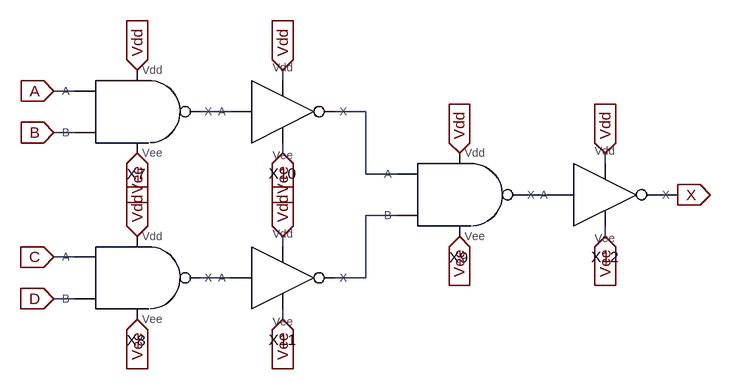
[diagram p0: schematic 4-NAND.asc]
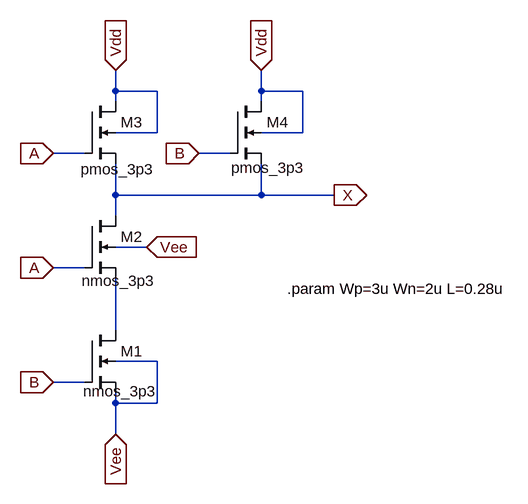
[diagram p1: sub-circuit nand2x1.asc]
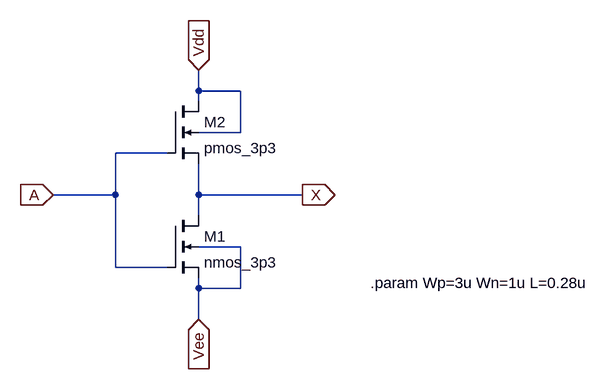
[diagram p2: sub-circuit invx1.asc]
4-NAND.asc, the LTspice schematic file:
Version 4.1
SHEET 1 880 680
WIRE -32 -64 -32 -80
WIRE -352 -48 -384 -48
WIRE -112 -16 -160 -16
WIRE 96 -16 48 -16
WIRE -352 16 -384 16
WIRE -32 48 -32 32
WIRE 464 64 464 48
WIRE 96 80 96 -16
WIRE 144 80 96 80
WIRE 384 112 336 112
WIRE 576 112 544 112
WIRE 144 144 96 144
WIRE 464 176 464 160
WIRE -32 192 -32 176
WIRE -352 208 -384 208
WIRE -112 240 -160 240
WIRE 96 240 96 144
WIRE 96 240 48 240
WIRE -352 272 -384 272
WIRE -32 304 -32 288
FLAG -256 48 Vee
IOPIN -256 48 In
FLAG -32 -80 Vdd
IOPIN -32 -80 In
FLAG -32 48 Vee
IOPIN -32 48 In
FLAG -256 304 Vee
IOPIN -256 304 In
FLAG -32 176 Vdd
IOPIN -32 176 In
FLAG -32 304 Vee
IOPIN -32 304 In
FLAG 240 176 Vee
IOPIN 240 176 In
FLAG 464 48 Vdd
IOPIN 464 48 In
FLAG 464 176 Vee
IOPIN 464 176 In
FLAG 576 112 X
IOPIN 576 112 Out
FLAG -384 -48 A
IOPIN -384 -48 In
FLAG -384 16 B
IOPIN -384 16 In
FLAG -384 208 C
IOPIN -384 208 In
FLAG -384 272 D
IOPIN -384 272 In
FLAG 240 48 Vdd
IOPIN 240 48 In
FLAG -256 -80 Vdd
IOPIN -256 -80 In
FLAG -256 176 Vdd
IOPIN -256 176 In
SYMBOL NAND2x1 -256 -16 R0
SYMATTR InstName X7
SYMBOL NAND2x1 -256 240 R0
SYMATTR InstName X8
SYMBOL NAND2x1 240 112 R0
SYMATTR InstName X9
SYMBOL INVx1 -32 -16 R0
SYMATTR InstName X10
SYMBOL INVx1 -32 240 R0
SYMATTR InstName X11
SYMBOL INVx1 464 112 R0
SYMATTR InstName X12

nand2x1.asc, the sub-circuit schematic file:
Version 4.1
SHEET 1 900 680
WIRE -96 32 -96 0
WIRE -32 32 -96 32
WIRE 128 32 128 0
WIRE 192 32 128 32
WIRE -96 48 -96 32
WIRE 128 48 128 32
WIRE -32 96 -32 32
WIRE -32 96 -96 96
WIRE 192 96 192 32
WIRE 192 96 128 96
WIRE -144 128 -192 128
WIRE 80 128 32 128
WIRE -96 192 -96 144
WIRE 128 192 128 144
WIRE 128 192 -96 192
WIRE 240 192 128 192
WIRE -96 224 -96 192
WIRE -48 272 -96 272
WIRE -144 304 -192 304
WIRE -96 400 -96 320
WIRE -32 448 -96 448
WIRE -144 480 -192 480
WIRE -96 512 -96 496
WIRE -32 512 -32 448
WIRE -32 512 -96 512
WIRE -96 560 -96 512
FLAG -96 0 Vdd
IOPIN -96 0 In
FLAG -192 128 A
IOPIN -192 128 In
FLAG 240 192 X
IOPIN 240 192 Out
FLAG 128 0 Vdd
IOPIN 128 0 In
FLAG -192 304 A
IOPIN -192 304 In
FLAG -192 480 B
IOPIN -192 480 In
FLAG 32 128 B
IOPIN 32 128 In
FLAG -96 560 Vee
IOPIN -96 560 In
FLAG -48 272 Vee
IOPIN -48 272 In
SYMBOL nmos4 -144 400 R0
WINDOW 3 -2 94 Left 2
SYMATTR Value nmos_3p3
SYMATTR InstName M1
SYMATTR Value2 l={L} w={Wn}
SYMBOL nmos4 -144 48 R0
WINDOW 3 -6 104 Left 2
SYMATTR Value pmos_3p3
SYMATTR InstName M3
SYMATTR Value2 l={L} w={Wp}
SYMBOL nmos4 80 48 R0
WINDOW 3 2 102 Left 2
SYMATTR Value pmos_3p3
SYMATTR InstName M4
SYMATTR Value2 l={L} w={Wp}
SYMBOL nmos4 -144 224 R0
WINDOW 3 -4 100 Left 2
SYMATTR Value nmos_3p3
SYMATTR InstName M2
SYMATTR Value2 l={L} w={Wn}
TEXT 168 336 Left 2 !.param Wp=3u Wn=2u L=0.28u

invx1.asc, the sub-circuit schematic file:
Version 4
SHEET 1 2776 836
WIRE 416 -16 416 -48
WIRE 480 -16 416 -16
WIRE 416 0 416 -16
WIRE 480 48 480 -16
WIRE 480 48 416 48
WIRE 368 80 288 80
WIRE 288 144 288 80
WIRE 288 144 192 144
WIRE 416 144 416 96
WIRE 576 144 416 144
WIRE 416 176 416 144
WIRE 480 224 416 224
WIRE 288 256 288 144
WIRE 368 256 288 256
WIRE 416 288 416 272
WIRE 480 288 480 224
WIRE 480 288 416 288
WIRE 416 336 416 288
FLAG 416 -48 Vdd
IOPIN 416 -48 In
FLAG 192 144 A
IOPIN 192 144 In
FLAG 576 144 X
IOPIN 576 144 Out
FLAG 416 336 Vee
IOPIN 416 336 In
SYMBOL nmos4 368 176 R0
SYMATTR InstName M1
SYMATTR Value nmos_3p3
SYMATTR Value2 l={L} w={Wn}
SYMBOL nmos4 368 0 R0
SYMATTR InstName M2
SYMATTR Value pmos_3p3
SYMATTR Value2 l={L} w={Wp}
TEXT 680 280 Left 2 !.param Wp=3u Wn=1u L=0.28u

The netlist it stands for:
* 4-NAND.asc
X§X7 A B Vdd N001 Vee nand2x1
X§X8 C D Vdd N005 Vee nand2x1
X§X9 N002 N004 Vdd N003 Vee nand2x1
X§X10 N001 Vdd N002 Vee invx1
X§X11 N005 Vdd N004 Vee invx1
X§X12 N003 Vdd X Vee invx1

* block symbol definitions
.subckt nand2x1 A B Vdd X Vee
M1 N001 B Vee Vee nmos_3p3 l={L} w={Wn}
M3 Vdd A X Vdd pmos_3p3 l={L} w={Wp}
M4 Vdd B X Vdd pmos_3p3 l={L} w={Wp}
M2 X A N001 Vee nmos_3p3 l={L} w={Wn}
.param Wp=3u Wn=2u L=0.28u
.ends nand2x1

.subckt invx1 A Vdd X Vee
M1 X A Vee Vee nmos_3p3 l={L} w={Wn}
M2 Vdd A X Vdd pmos_3p3 l={L} w={Wp}
.param Wp=3u Wn=1u L=0.28u
.ends invx1

.model NMOS NMOS
.model PMOS PMOS
.lib standard.mos
.backanno
.end